# EAGLE design BSPD_v7b (EAGLE 8.7.1)

## Sheet 1 of 2
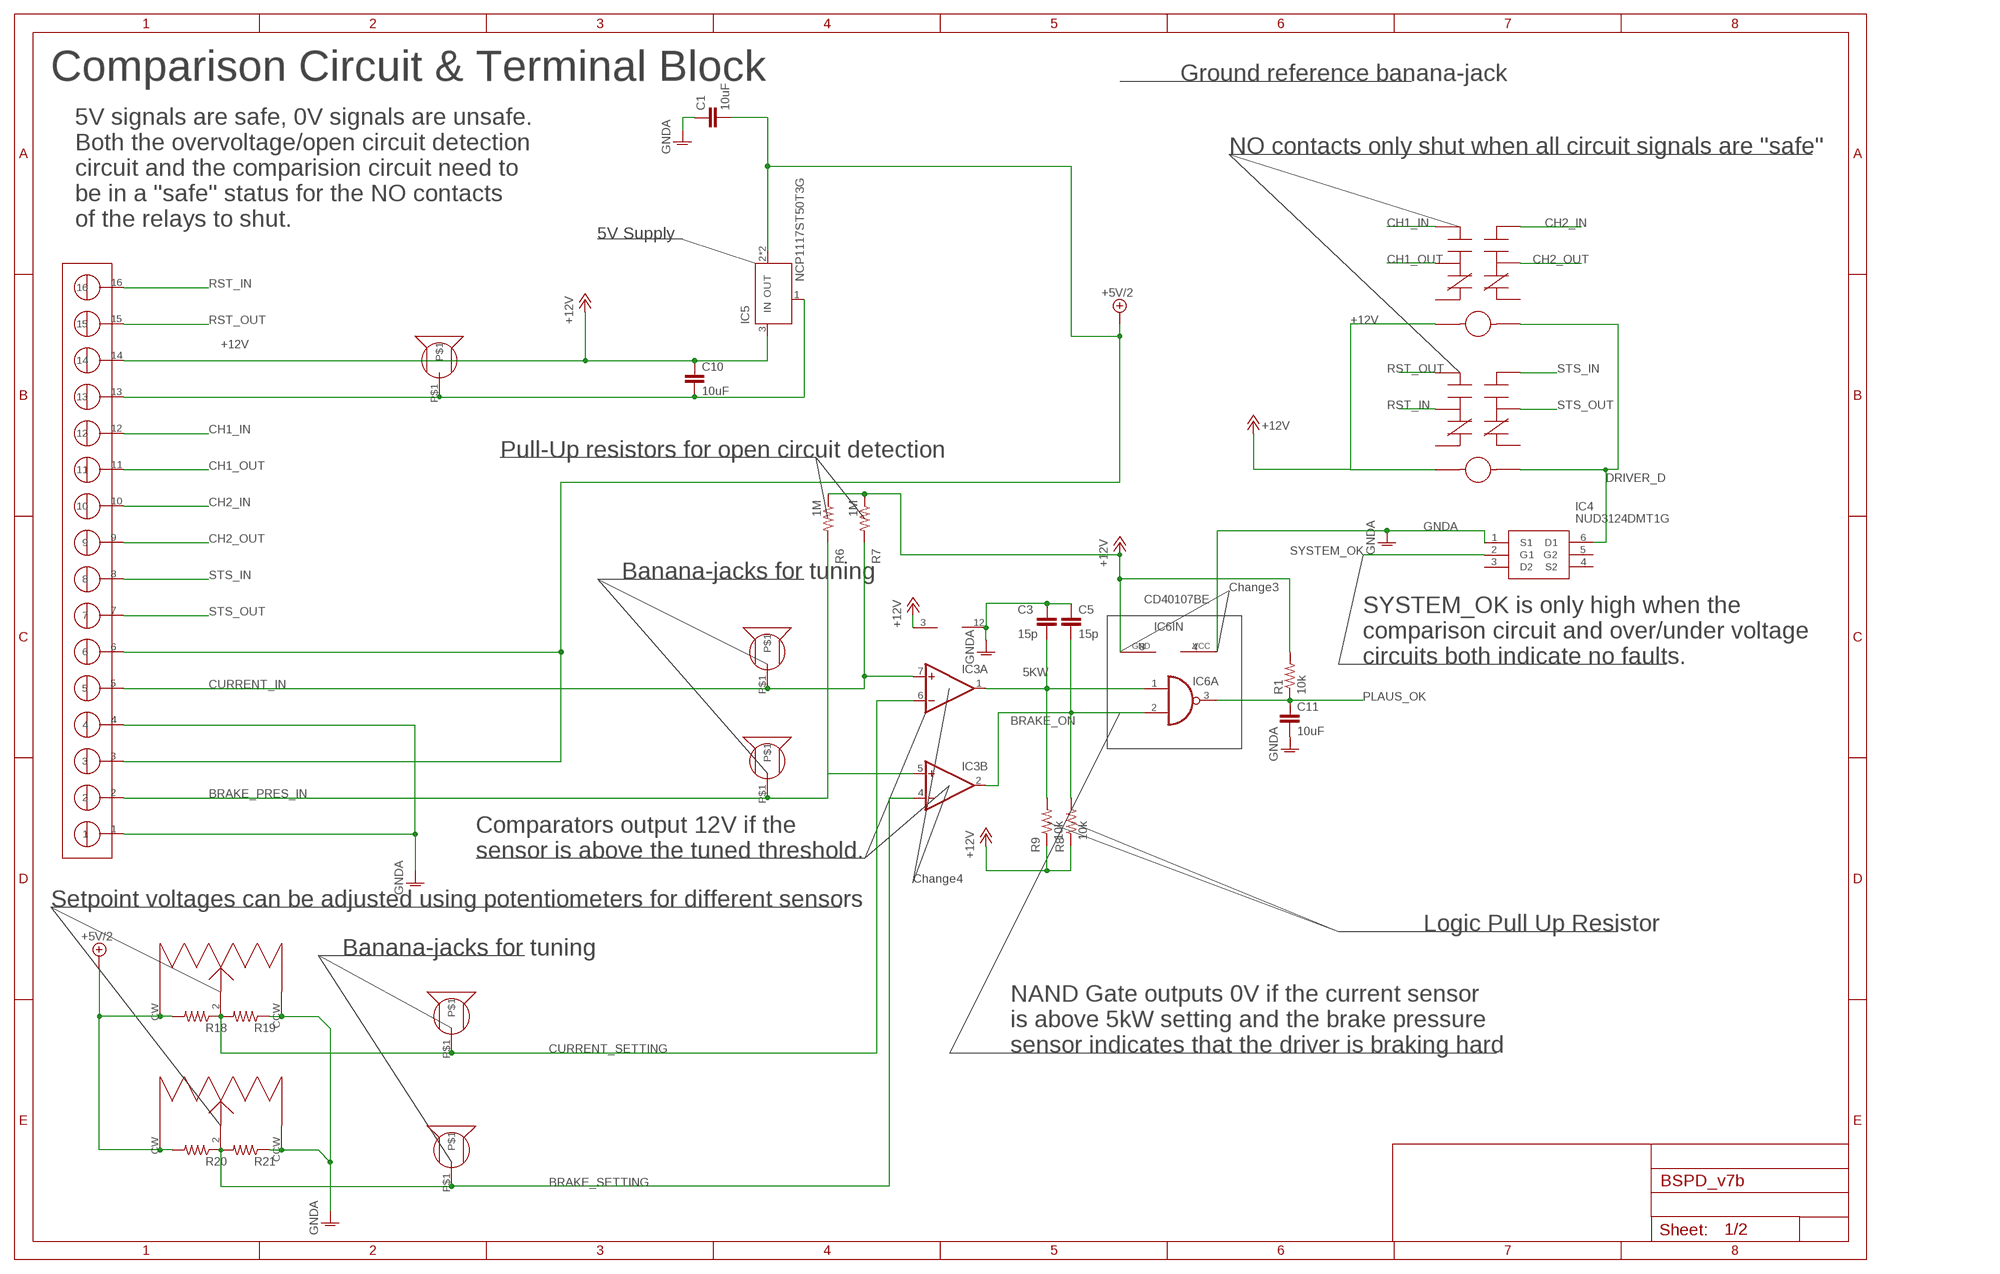
[diagram p0: schematic, sheet 1]

### Parts
C1  10uF  C-EUC0805  [C0805]
C3  15p  C-EUC0805  [C0805]
C5  15p  C-EUC0805  [C0805]
C10  10uF  C-EUC0805  [C0805]
C11  10uF  C-EUC0805  [C0805]
IC3  4AMP_P11+7N  [DIL14]
IC4  NUD3124DMT1G  [SOT95P275X110-6N]
IC5  NCP1117ST50T3G  [SOT223]
IC6  CD40107BE  [DIL08]
R1  10k  R-US_M0805  [M0805]
R6  1M  R-US_M0805  [M0805]
R7  1M  R-US_M0805  [M0805]
R8  10k  R-US_M0805  [M0805]
R9  10k  R-US_M0805  [M0805]
R18  R-US_M0805  [M0805]
R19  R-US_M0805  [M0805]
R20  R-US_M0805  [M0805]
R21  R-US_M0805  [M0805]
U$1  BSPD_PARTS_AMPH_OQ1632500000G  [BSPD_PARTS_3_81MM_16PIN]
U$4  BSPD_PARTS_MP_BANANA_PLUG  [BSPD_PARTS_BANANA_PLUG]
U$10  POT_3310Y-025-103L  [3310Y]
U$11  POT_3310Y-025-103L  [3310Y]
U$12  BSPD_PARTS_RLY_V23079A1001B301  [BSPD_PARTS_V23079F1101B301]
U$13  BSPD_PARTS_RLY_V23079A1001B301  [BSPD_PARTS_V23079F1101B301]
U$18  BSPD_PARTS_MP_BANANA_PLUG  [BSPD_PARTS_BANANA_PLUG]
U$19  BSPD_PARTS_MP_BANANA_PLUG  [BSPD_PARTS_BANANA_PLUG]
U$21  BSPD_PARTS_MP_BANANA_PLUG  [BSPD_PARTS_BANANA_PLUG]
U$22  BSPD_PARTS_MP_BANANA_PLUG  [BSPD_PARTS_BANANA_PLUG]

### Nets
5KW: C3.2 IC3.1(A:OUT) IC6.1(A:I0) R9.2
+5V/2: C1.2 IC5.2(OUT) IC5.4(OUT) R18.2 R20.2 U$1.3 U$1.6 U$10.CW U$11.CW ; also sheet 2
+12V: C10.1 IC3.3(P:V+) IC5.3(IN) IC6.8(IN:GND) R1.2 R6.1 R7.1 R8.1 R9.1 U$1.14 U$12.1 U$13.1 ; also sheet 2
BRAKE_ON: C5.2 IC3.2(B:OUT) IC6.2(A:I1) R8.2
BRAKE_PRES_IN: IC3.5(B:+IN) R6.2 U$1.2 U$22.P$1 ; also sheet 2
BRAKE_SETTING: IC3.4(B:-IN) R20.1 R21.2 U$10.2(VO) U$19.P$1
CH1_IN: U$1.12 U$13.5
CH1_OUT: U$1.11 U$13.4
CH2_IN: U$1.10 U$13.8
CH2_OUT: U$1.9 U$13.9
CURRENT_IN: IC3.7(A:+IN) R7.2 U$1.5 U$21.P$1 ; also sheet 2
CURRENT_SETTING: IC3.6(A:-IN) R18.1 R19.2 U$11.2(VO) U$18.P$1
DRIVER_D: IC4.6(D1) U$12.12 U$13.12
GNDA: C1.1 C3.1 C5.1 C10.2 C11.2 IC3.12(P:V-) IC4.1(S1) IC5.1(GND) IC6.4(IN:VCC) R19.1 R21.1 U$1.1 U$1.4 U$1.13 U$4.P$1 U$10.CCW U$11.CCW ; also sheet 2
PLAUS_OK: C11.1 IC6.3(A:O) R1.1 ; also sheet 2
RST_IN: U$1.16 U$12.4
RST_OUT: U$1.15 U$12.5
STS_IN: U$1.8 U$12.8
STS_OUT: U$1.7 U$12.9
SYSTEM_OK: IC4.2(G1) ; also sheet 2
Unconnected: IC3.8(C:-IN) IC3.9(C:+IN) IC3.10(D:-IN) IC3.11(D:+IN) IC3.13(D:OUT) IC3.14(C:OUT) IC4.3(D2) IC4.4(S2) IC4.5(G2) IC6.5(B:O) IC6.6(B:I0) IC6.7(B:I1) U$12.3 U$12.10 U$13.3 U$13.10

### Notes on the sheet
- Comparison Circuit & Terminal Block | Ground reference banana-jack
- NO contacts only shut when all circuit signals are "safe"
- 5V signals are safe, 0V signals are unsafe.
  Both the overvoltage/open circuit detection
  circuit and the comparision circuit need to
  be in a "safe" status for the NO contacts
  of the relays to shut.
- 5V Supply
- Pull-Up resistors for open circuit detection
- Banana-jacks for tuning
- Change3
- SYSTEM_OK is only high when the
  comparison circuit and over/under voltage 
  circuits both indicate no faults.
- Comparators output 12V if the 
  sensor is above the tuned threshold.
- Change4
- Setpoint voltages can be adjusted using potentiometers for different sensors
- Logic Pull Up Resistor
- Banana-jacks for tuning
- NAND Gate outputs 0V if the current sensor
  is above 5kW setting and the brake pressure
  sensor indicates that the driver is braking hard

## Sheet 2 of 2
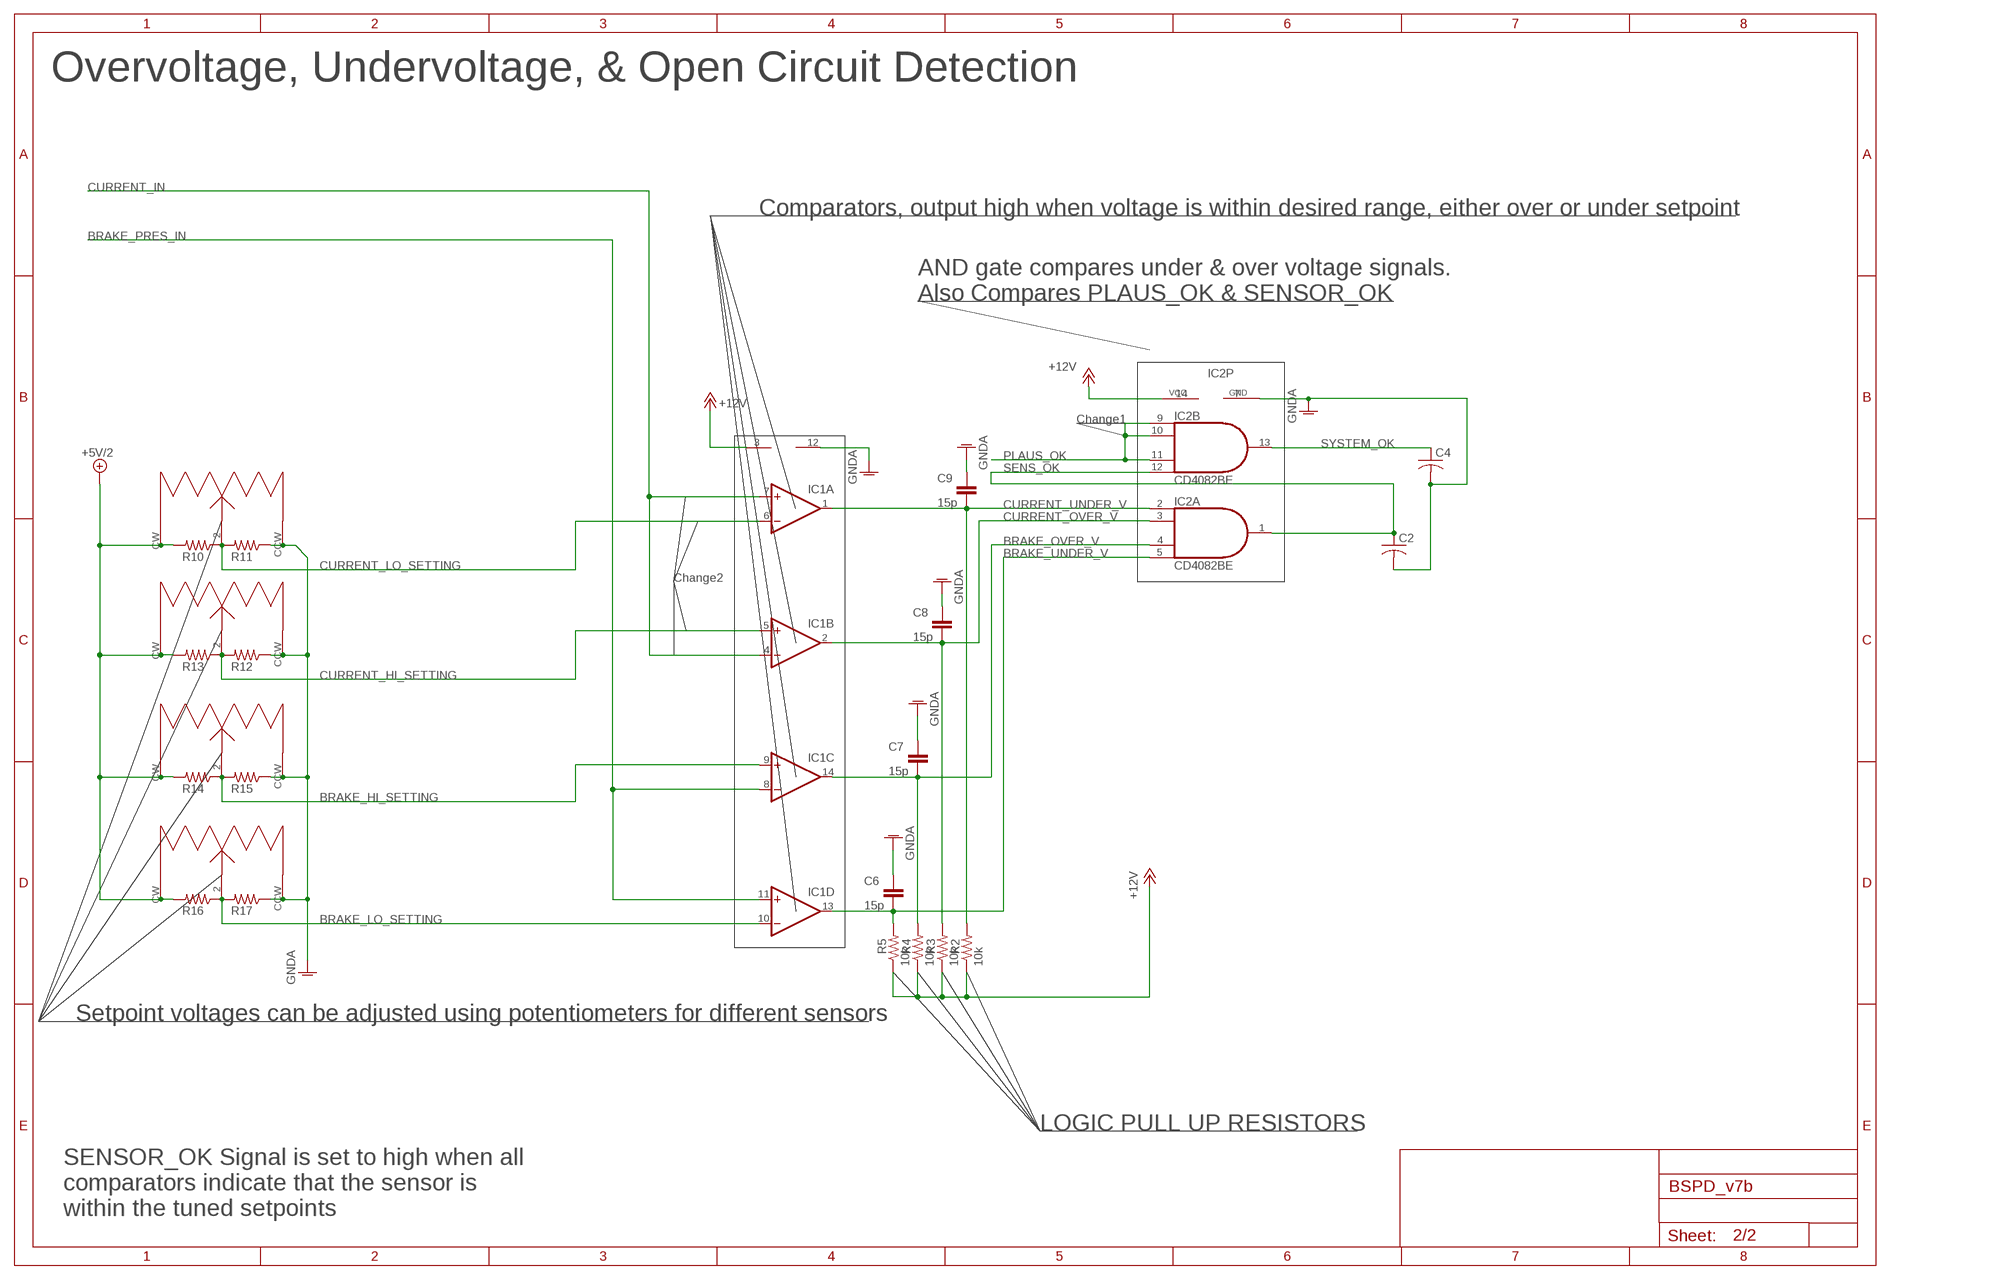
[diagram p1: schematic, sheet 2]

### Parts
C2  C-USC0805  [C0805]
C4  C-USC0805  [C0805]
C6  15p  C-EUC0805  [C0805]
C7  15p  C-EUC0805  [C0805]
C8  15p  C-EUC0805  [C0805]
C9  15p  C-EUC0805  [C0805]
IC1  4AMP_P11+7N  [DIL14]
IC2  CD4082BE  74ALS21N  [DIL14]
R2  10k  R-US_M0805  [M0805]
R3  10k  R-US_M0805  [M0805]
R4  10k  R-US_M0805  [M0805]
R5  10k  R-US_M0805  [M0805]
R10  R-US_M0805  [M0805]
R11  R-US_M0805  [M0805]
R12  R-US_M0805  [M0805]
R13  R-US_M0805  [M0805]
R14  R-US_M0805  [M0805]
R15  R-US_M0805  [M0805]
R16  R-US_M0805  [M0805]
R17  R-US_M0805  [M0805]
U$6  POT_3310Y-025-103L  [3310Y]
U$7  POT_3310Y-025-103L  [3310Y]
U$8  POT_3310Y-025-103L  [3310Y]
U$9  POT_3310Y-025-103L  [3310Y]

### Nets
+5V/2: R10.2 R13.2 R14.2 R16.2 U$6.CW U$7.CW U$8.CW U$9.CW ; also sheet 1
+12V: IC1.3(P:V+) IC2.14(P:VCC) R2.1 R3.1 R4.1 R5.1 ; also sheet 1
BRAKE_HI_SETTING: IC1.9(C:+IN) R14.1 R15.2 U$8.2(VO)
BRAKE_LO_SETTING: IC1.10(D:-IN) R16.1 R17.2 U$9.2(VO)
BRAKE_OVER_V: C7.2 IC1.14(C:OUT) IC2.4(A:I2) R4.2
BRAKE_PRES_IN: IC1.8(C:-IN) IC1.11(D:+IN) ; also sheet 1
BRAKE_UNDER_V: C6.2 IC1.13(D:OUT) IC2.5(A:I3) R5.2
CURRENT_HI_SETTING: IC1.5(B:+IN) R12.2 R13.1 U$7.2(VO)
CURRENT_IN: IC1.4(B:-IN) IC1.7(A:+IN) ; also sheet 1
CURRENT_LO_SETTING: IC1.6(A:-IN) R10.1 R11.2 U$6.2(VO)
CURRENT_OVER_V: C8.2 IC1.2(B:OUT) IC2.3(A:I1) R3.2
CURRENT_UNDER_V: C9.2 IC1.1(A:OUT) IC2.2(A:I0) R2.2
GNDA: C2.2 C4.2 C6.1 C7.1 C8.1 C9.1 IC1.12(P:V-) IC2.7(P:GND) R11.1 R12.1 R15.1 R17.1 U$6.CCW U$7.CCW U$8.CCW U$9.CCW ; also sheet 1
PLAUS_OK: IC2.9(B:I0) IC2.10(B:I1) IC2.11(B:I2) ; also sheet 1
SENS_OK: C2.1 IC2.1(A:O) IC2.12(B:I3)
SYSTEM_OK: C4.1 IC2.13(B:O) ; also sheet 1

### Notes on the sheet
- Overvoltage, Undervoltage, & Open Circuit Detection
- Comparators, output high when voltage is within desired range, either over or under setpoint
- AND gate compares under & over voltage signals.
  Also Compares PLAUS_OK & SENSOR_OK
- Change1
- Change2
- Setpoint voltages can be adjusted using potentiometers for different sensors
- LOGIC PULL UP RESISTORS
- SENSOR_OK Signal is set to high when all 
  comparators indicate that the sensor is 
  within the tuned setpoints

## Library data of the parts
C1 C10 C11 = resistor:C-EU: CAPACITOR, European symbol
C2 C4 = rcl:C-US: CAPACITOR, American symbol; SPICEPREFIX: C
C3 C5-C9 = rcl:C-EU: CAPACITOR, European symbol; SPICEPREFIX: C
IC1 IC3 = BSPD_REV6:4AMP_P11+7: OP AMP
IC2 = BSPD_REV6:74*21: Dual 4-input AND gate
IC4 = SamacSys_Parts:NUD3124DMT1G: Automotive Inductive Load Driver Source: Datasheet <https://componentsearchengine.com/Datasheets/1/NUD3124DMT1G.pdf>; DESCRIPTION: Automotive Inductive Load Driver; HEIGHT: 1.1mm; MANUFACTURER_NAME: ON Semiconductor; MANUFACTURER_PART_NUMBER: NUD3124DMT1G; MOUSER_PART_NUMBER: 863-NUD3124DMT1G
IC5 = BSPD_REV6:NCP1117ST50T3G
IC6 = BSPD_REV6:CD40107BE
R1 = rcl:R-US_: RESISTOR, American symbol; SPICEPREFIX: R
R2-R21 = resistor:R-US_: RESISTOR, American symbol
U$1 = BSPD_v4:BSPD_PARTS_AMPH_OQ1632500000G
U$4 U$18 U$19 U$21 U$22 = BSPD_v4:BSPD_PARTS_MP_BANANA_PLUG
U$6-U$11 = BSPD_PARTS:POT_3310Y-025-103L
U$12 U$13 = BSPD_v4:BSPD_PARTS_RLY_V23079A1001B301

## Net classes
0 default: width 0.3 mm, drill 0.2 mm, clearance 0.2 mm

## Board
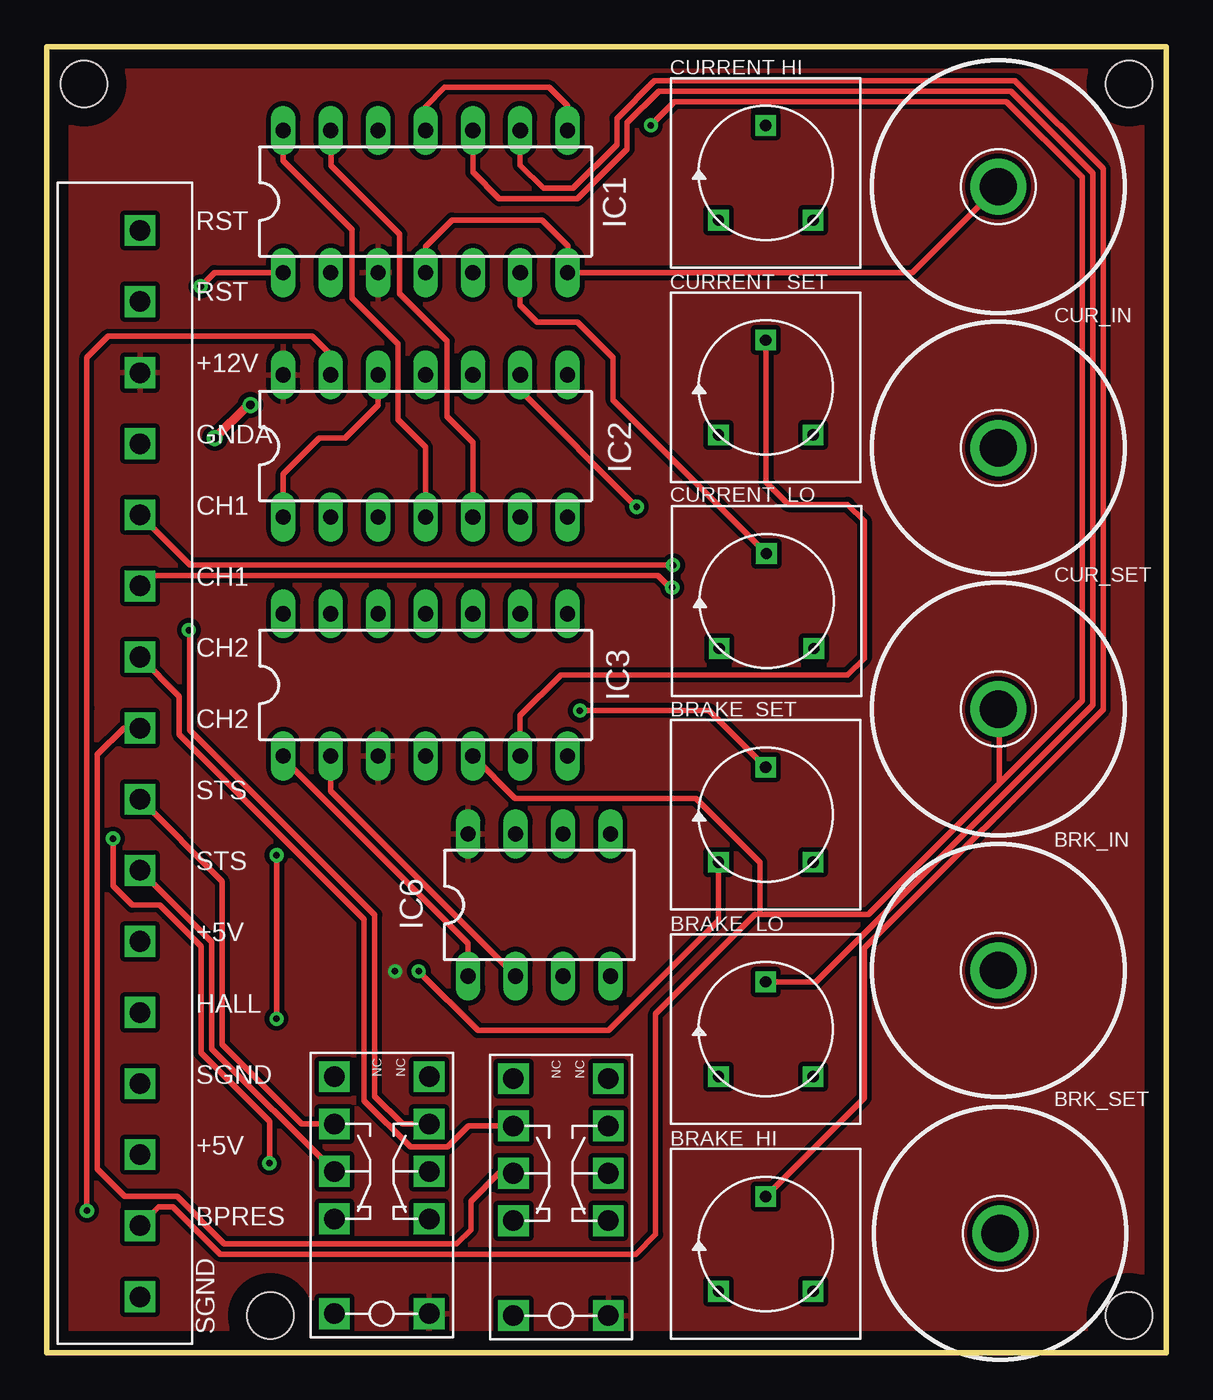
[diagram p2: board, top side]
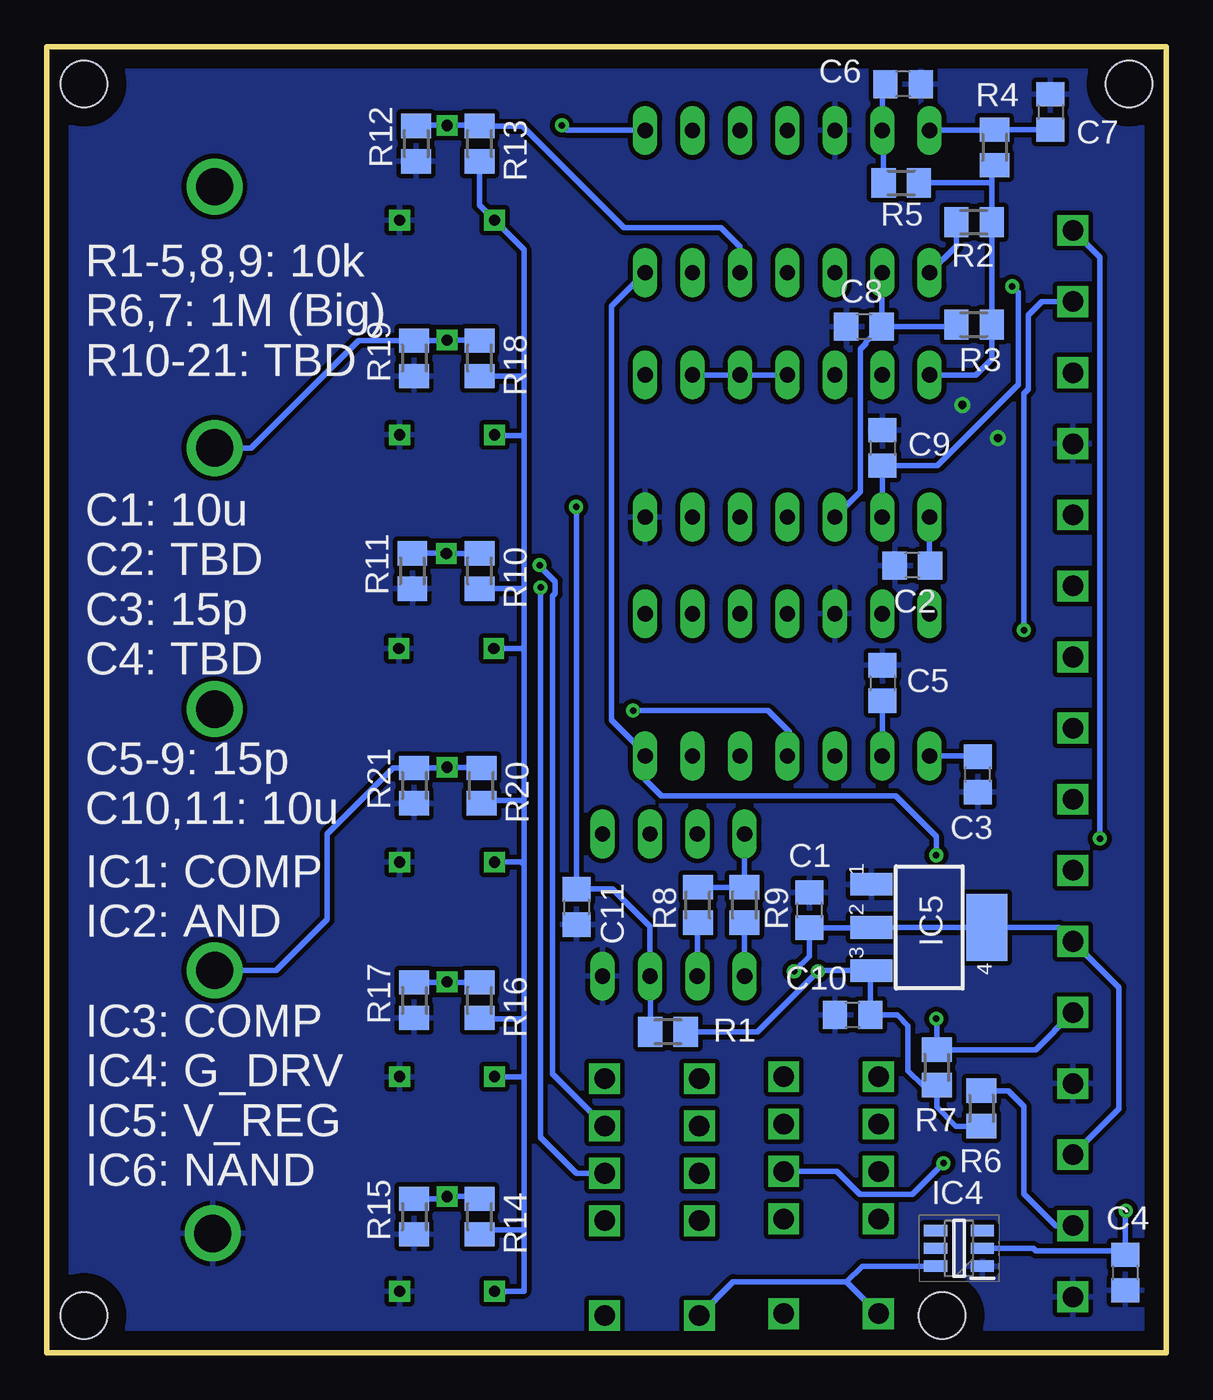
[diagram p3: board, bottom side, seen from below]

Size 60 x 70 mm. Coordinates in mm from the lower left corner, seen from the top.
Outline: 0,0 60,0 60,70 0,70 0,0
Copper layers (1*16): Top 0.035mm / dielectric 1.5mm / Bottom 0.035mm
Design rules "default *": minimum track width 6mil, minimum drill 0.35mm, track to track 10mil, track to pad 10mil, pad to pad 10mil, via to via 10mil, smd to smd 10mil, copper to edge 40mil, drill to drill 10mil, minimum pad ring 10mil, minimum via ring 8mil, stop-mask expansion 4mil, vias tented up to drill 0mil, thermal gap 10mil
Holes 2.5 mm at 2,68 12,2 58,68 58,2

### Footprints (pad centres in the part's own frame; a part is rotated, then mirrored left to right if it is on the bottom)
C0805 = smd 1.3 x 1.5: 1 -0.95,0; 2 0.95,0
DIL14 = drill 0.813 long: 1 -7.62,-3.81; 2 -5.08,-3.81; 3 -2.54,-3.81; 4 0,-3.81; 5 2.54,-3.81; 6 5.08,-3.81; 7 7.62,-3.81; 8 7.62,3.81; 9 5.08,3.81; 10 2.54,3.81; 11 0,3.81; 12 -2.54,3.81; 13 -5.08,3.81; 14 -7.62,3.81
SOT95P275X110-6N = smd 1.25 x 0.6: 1 -1.25,0.95; 2 -1.25,0; 3 -1.25,-0.95; 4 1.25,-0.95; 5 1.25,0; 6 1.25,0.95
SOT223 = smd 1.219 x 2.235: 1 -2.311,-3.099; 2 0,-3.099; 3 2.311,-3.099 | smd 3.6 x 2.2: 4 0,3.099
DIL08 = drill 0.813 long: 1 -3.81,-3.81; 2 -1.27,-3.81; 3 1.27,-3.81; 4 3.81,-3.81; 5 3.81,3.81; 6 1.27,3.81; 7 -1.27,3.81; 8 -3.81,3.81
M0805 = smd 1.3 x 1.6: 1 -0.95,0; 2 0.95,0
BSPD_PARTS_3_81MM_16PIN = drill 1.1 square: 1 0,0; 2 3.81,0; 3 7.62,0; 4 11.43,0; 5 15.24,0; 6 19.05,0; 7 22.86,0; 8 26.67,0; 9 30.48,0; 10 34.29,0; 11 38.1,0; 12 41.91,0; 13 45.72,0; 14 49.53,0; 15 53.34,0; 16 57.15,0
BSPD_PARTS_BANANA_PLUG = drill 2 pad 3: P$1 0,0
3310Y = drill 0.6 square: 2 2.54,5.08; CCW 5.08,0; CW 0,0
BSPD_PARTS_V23079F1101B301 = drill 1.1 square: 1 0,0; 3 5.08,0; 4 7.62,0; 5 10.16,0; 6 12.7,0; 7 12.7,5.08; 8 10.16,5.08; 9 7.62,5.08; 10 5.08,5.08; 12 0,5.08

### Placement (x,y rotation side)
C1  19.13,23.73 270 bottom
C2  13.6,42.2 180 bottom
C3  10.1,31 90 bottom
C4  2.2,4.3 270 bottom
C5  15.2,35.9 270 bottom
C6  14.1,68 180 bottom
C7  6.2,66.5 270 bottom
C8  16.2,55 0 bottom
C9  15.2,48.5 270 bottom
C10  16.8,18.1 180 bottom
C11  31.6,23.9 270 bottom
IC1  20.3,61.7 0 top
IC2  20.3,48.6 0 top
IC3  20.3,35.8 0 top
IC4  11.1,5.6 180 bottom
IC5  12.7,22.8 270 bottom
IC6  26.4,24 0 top
R1  26.7,17.2 0 bottom
R2  10.3,60.6 180 bottom
R3  10.3,55.1 180 bottom
R4  9.2,64.6 90 bottom
R5  14.2,62.7 180 bottom
R6  9.9,13.1 90 bottom
R7  12.3,15.3 90 bottom
R8  25.1,24 270 bottom
R9  22.6,24 270 bottom
R10  36.8,41.9 270 bottom
R11  40.4,41.9 90 bottom
R12  40.2,64.8 90 bottom
R13  36.8,64.8 270 bottom
R14  36.8,7.3 270 bottom
R15  40.3,7.3 90 bottom
R16  36.8,18.9 270 bottom
R17  40.3,18.9 90 bottom
R18  36.8,53.3 270 bottom
R19  40.3,53.3 90 bottom
R20  36.7,30.4 270 bottom
R21  40.3,30.4 90 bottom
U$1  5,3 90 top
U$4  51.1,6.4 0 top
U$6  36.04,37.75 0 top
U$7  36,60.7 0 top
U$8  36,3.3 0 top
U$9  36,14.8 0 top
U$10  36,26.3 0 top
U$11  36,49.2 0 top
U$12  20.5,2.1 90 top
U$13  30.1,2 90 top
U$18  51,48.5 0 top
U$19  51,20.5 0 top
U$21  51,62.5 0 top
U$22  51,34.5 0 top

### Tracks (layer width: path | path; a pad name or v marks a point on that pad's centre or on a via)
5KW
  Top 0.305: IC6.1 22.59,21.94 12.68,31.85 IC3.1
  Bottom 0.305: IC3.1 10.14,31.99 C3.2 | R9.2 IC6.1
+5V/2  (via drill 0.35)
  Top 0.305: v19.94,20.45 23.11,17.27 30.1,17.27 36,23.17 U$10.CW
  Bottom 0.305: R13.2 36.8,61.5 U$7.CW 34.42,59.12 34.42,52.2 | 34.42,52.2 34.42,49.15 | 34.42,49.15 34.42,40.89 | 34.42,40.89 34.42,37.72 | R18.2 34.57,52.35 34.42,52.2 | 34.42,37.72 34.42,29.59 | 34.42,29.59 34.42,26.16 | 34.42,26.16 34.42,17.91 | 34.42,17.91 34.42,14.86 | U$11.CW 35.95,49.15 34.42,49.15 | U$6.CW 34.45,37.75 34.42,37.72 | U$10.CW 34.55,26.3 34.42,26.16 | 34.42,14.86 34.42,6.6 | 34.42,6.6 34.42,3.3 U$8.CW | U$9.CW 34.48,14.8 34.42,14.86 | U$1.3 2.54,13.08 2.54,19.59 U$1.6 5.75,22.8 IC5.4 IC5.2 15.82,22.78 C1.2 19.13,21.26 v19.94,20.45 | R14.2 36.55,6.6 34.42,6.6 | R16.2 36.76,17.91 34.42,17.91 | R20.2 36.56,29.59 34.42,29.59 | R10.2 34.47,40.95 34.42,40.89
+12V  (via drill 0.35)
  Bottom 0.305: R6.1 11.26,12.15 12.3,13.19 R7.1 13.08,14.35 13.84,15.11 13.84,17.53 14.42,18.1 C10.1 15.85,20.44 IC5.3 18.63,20.49 v18.67,20.45 21.92,17.2 R1.2 | IC2.14 10.2,52.41 9.35,53.26 R3.1 R2.1 9.35,62.61 | IC6.8 R9.1 R8.1 | R4.1 9.35,63.5 9.35,62.61 | 9.35,62.61 9.44,62.7 R5.1
  pour Top: 0.04,70 60,70 59.6,-1.01 2.24,-1.01 0.04,2.89
BRAKE_HI_SETTING
  Top 0.305: U$8.2 43.81,13.65 43.81,21.69 56.62,34.49 56.62,63.45 51.9,68.17 32.59,68.17 30.56,66.14 30.56,64.75 28.22,62.41 26.62,62.41 25.38,63.65 IC1.9
  Bottom 0.305: R15.2 38.67,8.25 U$8.2 36.93,8.38 R14.1
BRAKE_LO_SETTING
  Top 0.305: U$9.2 41.22,19.88 56.06,34.72 56.06,63.22 51.67,67.61 32.82,67.61 31.11,65.91 31.11,64.52 28.45,61.85 24.26,61.85 22.84,63.27 IC1.10
  Bottom 0.305: R17.2 38.57,19.85 U$9.2 38.51,19.85 R16.1
BRAKE_ON
  Top 0.305: IC6.2 15.22,30.1 IC3.2
  Bottom 0.305: C5.2 15.2,32.01 IC3.2 | IC6.2 25.13,23.02 R8.2
BRAKE_OVER_V
  Top 0.305: IC2.4 20.3,48.53 18.83,50.01 18.83,54.07 16.38,56.52 16.38,60.2 12.68,63.9 IC1.14
  Bottom 0.305: IC1.14 9.24,65.51 R4.2 C7.2
BRAKE_PRES_IN  (via drill 0.35)
  Top 0.305: IC1.8 27.92,66.82 26.92,67.82 21.34,67.82 20.3,66.78 IC1.11 | U$22.P$1 51.05,34.55 51.05,30.5 | v32.38,65.79 33.66,67.06 51.44,67.06 55.5,62.99 55.5,34.95 51.05,30.5 | U$1.2 6.01,7.82 6.75,7.82 9.29,5.28 31.57,5.28 32.64,6.35 32.64,18.16 37.97,23.5 38.23,23.5 | 38.23,23.5 44.04,23.5 51.05,30.5 | 38.23,23.5 38.23,26.29 34.8,29.72 25.11,29.72 IC3.5
  Bottom 0.305: R6.2 8.46,14.05 7.62,13.21 7.62,8.51 5.92,6.81 U$1.2 | v32.38,65.79 32.11,65.51 IC1.8
BRAKE_SETTING  (via drill 0.35)
  Top 0.305: U$10.2 35.5,34.42 v28.57,34.42
  Bottom 0.305: R20.1 36.73,31.38 U$10.2 38.57,31.35 R21.2 41.42,31.35 44.96,27.81 44.96,23.24 47.7,20.5 U$19.P$1 | v28.57,34.42 21.34,34.42 20.19,33.27 20.19,32.1 IC3.4
BRAKE_UNDER_V
  Top 0.305: IC2.5 22.84,48.79 21.46,50.16 21.46,54.23 18.92,56.77 18.92,59.94 15.24,63.63 15.24,65.49 IC1.13
  Bottom 0.305: C6.2 15.22,67.83 IC1.13 15.15,65.44 R5.2
CH1_IN  (via drill 0.35)
  Top 0.305: U$1.12 7.7,42.22 33.25,42.22 33.26,42.21 v33.58,42.21
  Bottom 0.305: U$13.5 32.89,14.95 32.89,40.01 32.89,40.55 32.74,40.7 32.74,41.35 33.58,42.18 v33.58,42.21
CH1_OUT  (via drill 0.35)
  Top 0.305: U$1.11 5.56,41.66 32.77,41.66 33.4,41.02 v33.53,41.02
  Bottom 0.305: U$13.4 31.59,9.62 33.53,11.56 v33.53,41.02
CH2_IN
  Top 0.305: U$13.8 22.62,12.16 21.49,11.03 19.51,11.03 17.02,13.52 17.02,23.24 7.11,33.15 7.11,35.18 U$1.10
CH2_OUT
  Top 0.305: U$1.9 4.14,33.48 2.72,32.05 2.72,9.86 4.19,8.38 6.99,8.38 9.53,5.84 21.97,5.84 22.73,6.6 22.73,8.13 24.23,9.62 U$13.9
CURRENT_HI_SETTING
  Bottom 0.305: R12.2 40.17,65.78 U$7.2 36.83,65.78 R13.1 34.51,65.75 29.06,60.3 23.86,60.3 22.84,59.29 IC1.5
CURRENT_IN  (via drill 0.35)
  Top 0.305: IC1.4 20.3,59.29 21.72,60.71 26.54,60.71 27.94,59.31 27.94,57.91 IC1.7 46.39,57.89 U$21.P$1 | v12.32,26.67 v12.32,17.91
  Bottom 0.305: U$1.5 6.99,16.25 R7.2 12.3,17.89 v12.32,17.91 | 27.94,31.97 27.94,30.73 27.05,29.84 14.48,29.84 12.32,27.69 v12.32,26.67 | 27.94,31.97 IC3.7 | IC1.7 29.72,56.09 29.72,33.91 27.94,32.13 27.94,31.97
CURRENT_LO_SETTING
  Top 0.305: U$6.2 30.35,51.06 30.35,53.34 28.45,55.24 26.29,55.24 25.38,56.15 IC1.6
  Bottom 0.305: R11.2 38.6,42.85 U$6.2 36.82,42.83 R10.1
CURRENT_OVER_V
  Bottom 0.305: IC2.3 16.38,46.17 16.38,53.79 16.09,54.08 16.09,54.16 C8.2 | C8.2 11.35,55 R3.2 | C8.2 15.25,57.86 IC1.2
CURRENT_SETTING
  Top 0.305: U$11.2 38.54,46.68 39.75,45.47 42.93,45.47 43.81,44.58 43.81,37.21 42.93,36.32 27.56,36.32 25.38,34.14 IC3.6
  Bottom 0.305: U$18.P$1 49.04,48.5 43.29,54.25 R19.2 38.57,54.25 U$11.2 36.83,54.28 R18.1
CURRENT_UNDER_V  (via drill 0.35)
  Top 0.305: v8.26,57.15 8.99,57.89 IC1.1
  Bottom 0.305: IC2.2 15.2,44.81 C9.2 12.27,47.55 7.94,51.88 7.94,56.83 v8.26,57.15 | IC1.1 11.25,59.32 R2.2
DRIVER_D
  Bottom 0.305: U$13.12 23.21,3.81 17.13,3.81 | 17.13,3.81 U$12.12 | 17.13,3.81 16.29,4.65 IC4.6
GNDA  (via drill 0.45)
  Top 0.508: v9.02,49.02 10.79,50.8 v10.92,50.8
  pour Bottom: -3,73 63,73 63,-2 -1,-2 -3,0
PLAUS_OK  (via drill 0.35)
  Top 0.305: v31.62,45.34 25.38,51.58 IC2.9
  Bottom 0.305: R1.1 27.65,20.17 IC6.3 27.67,22.84 29.68,24.85 C11.1 31.6,45.32 v31.62,45.34 | IC2.9 IC2.10 IC2.11
RST_IN  (via drill 0.35)
  Top 0.305: v3.56,27.56 3.56,25.02 4.57,24 6.07,24 8.28,21.79 8.28,16.07 11.94,12.41 v11.94,10.16
  Bottom 0.305: U$12.4 17.64,9.72 16.41,8.49 13.61,8.49 v11.94,10.16 | v3.56,27.56 3.56,58.71 U$1.16
RST_OUT  (via drill 0.35)
  Top 0.305: U$12.5 19.07,12.26 17.58,13.75 17.58,23.47 7.67,33.38 7.67,38.68 v7.62,38.73
  Bottom 0.305: U$1.15 6.65,56.34 7.38,55.61 7.38,51.65 7.62,51.41 v7.62,38.73
SENS_OK
  Top 0.305: IC2.1 12.68,47.1 14.61,49.02 16,49.02 17.76,50.78 IC2.12
  Bottom 0.305: IC2.1 12.68,42.23 C2.1
STS_IN
  Top 0.305: U$1.8 9.4,25.27 9.4,16.53 13.67,12.26 U$12.8
STS_OUT
  Top 0.305: U$12.9 8.84,16.3 8.84,22.02 U$1.7
SYSTEM_OK  (via drill 0.35)
  Top 0.305: v2.16,7.62 2.16,31.5 | 2.16,31.5 2.16,32.38 2.16,32.64 2.16,34.54 2.16,53.34 3.3,54.48 14.22,54.48 15.22,53.49 IC2.13 | 2.16,31.5
  Bottom 0.305: 2.55,5.6 2.41,5.46 | 2.41,5.46 C4.1 2.2,7.58 v2.16,7.62 | IC4.2 7.12,5.6 6.99,5.46 2.41,5.46

### Text on the board
tPlace: CURRENT HI | RST | CURRENT_SET | RST | CUR_IN | +12V | GNDA | CURRENT_LO | CH1 | CH1 | CUR_SET | CH2 | BRAKE_SET | CH2 | STS | BRK_IN | STS | BRAKE_LO | +5V | HALL | SGND | BRK_SET | +5V | BRAKE_HI | BPRES | SGND
bPlace: R1-5,8,9: 10k / R6,7: 1M (Big) / R10-21: TBD / / / C1: 10u / C2: TBD / C3: 15p / C4: TBD / / C5-9: 15p / C10,11: 10u | IC1: COMP / IC2: AND / / IC3: COMP / IC4: G_DRV / IC5: V_REG / IC6: NAND
tTest: CUT HERE | CUT HERE | CUT HERE | CUT HERE
bTest: CUT HERE | CUT HERE | CUT HERE | CUT HERE